# Altium schematic sheet BMS029B_Monitor.SchDoc: Monitor
size 431 x 279 mm; Date: Not shown in title block; ApprovedBy: Not shown in title block; CheckedBy: Not shown in title block; Author: Not shown in title block; CompanyName: Not shown in title block; Engineer: Not shown in title block; Organization: Not shown in title block; Address1: Not shown in title block; Address2: Not shown in title block; Address3: Not shown in title block; Address4: Not shown in title block; DocumentNumber: 1; Revision: Use project parameter SCH_Rev; SheetNumber: 1; SheetTotal: 5; PageSetup: Record=PageOptions|CenterHorizontal=True|CenterVertical=True|PrintScale=1.00|XCorrection=1.00|YCorrection=1.00|PrintKind=0|BorderSize=5000000|LeftOffset=0|BottomOffset=0|Orientation=2|PaperLength=1000|PaperWidth=1000|Scale=100|PaperSource=15|PrintQuality=600|MediaType=1|DitherType=10|PaperKind=Letter|PrintScaleMode=1; CurrentTime: Not shown in title block; CurrentDate: Not shown in title block; Time: Not shown in title block; DocumentFullPathAndName: Not shown in title block; DocumentName: Not shown in title block; ModifiedDate: Not shown in title block; ImagePath: Not shown in title block
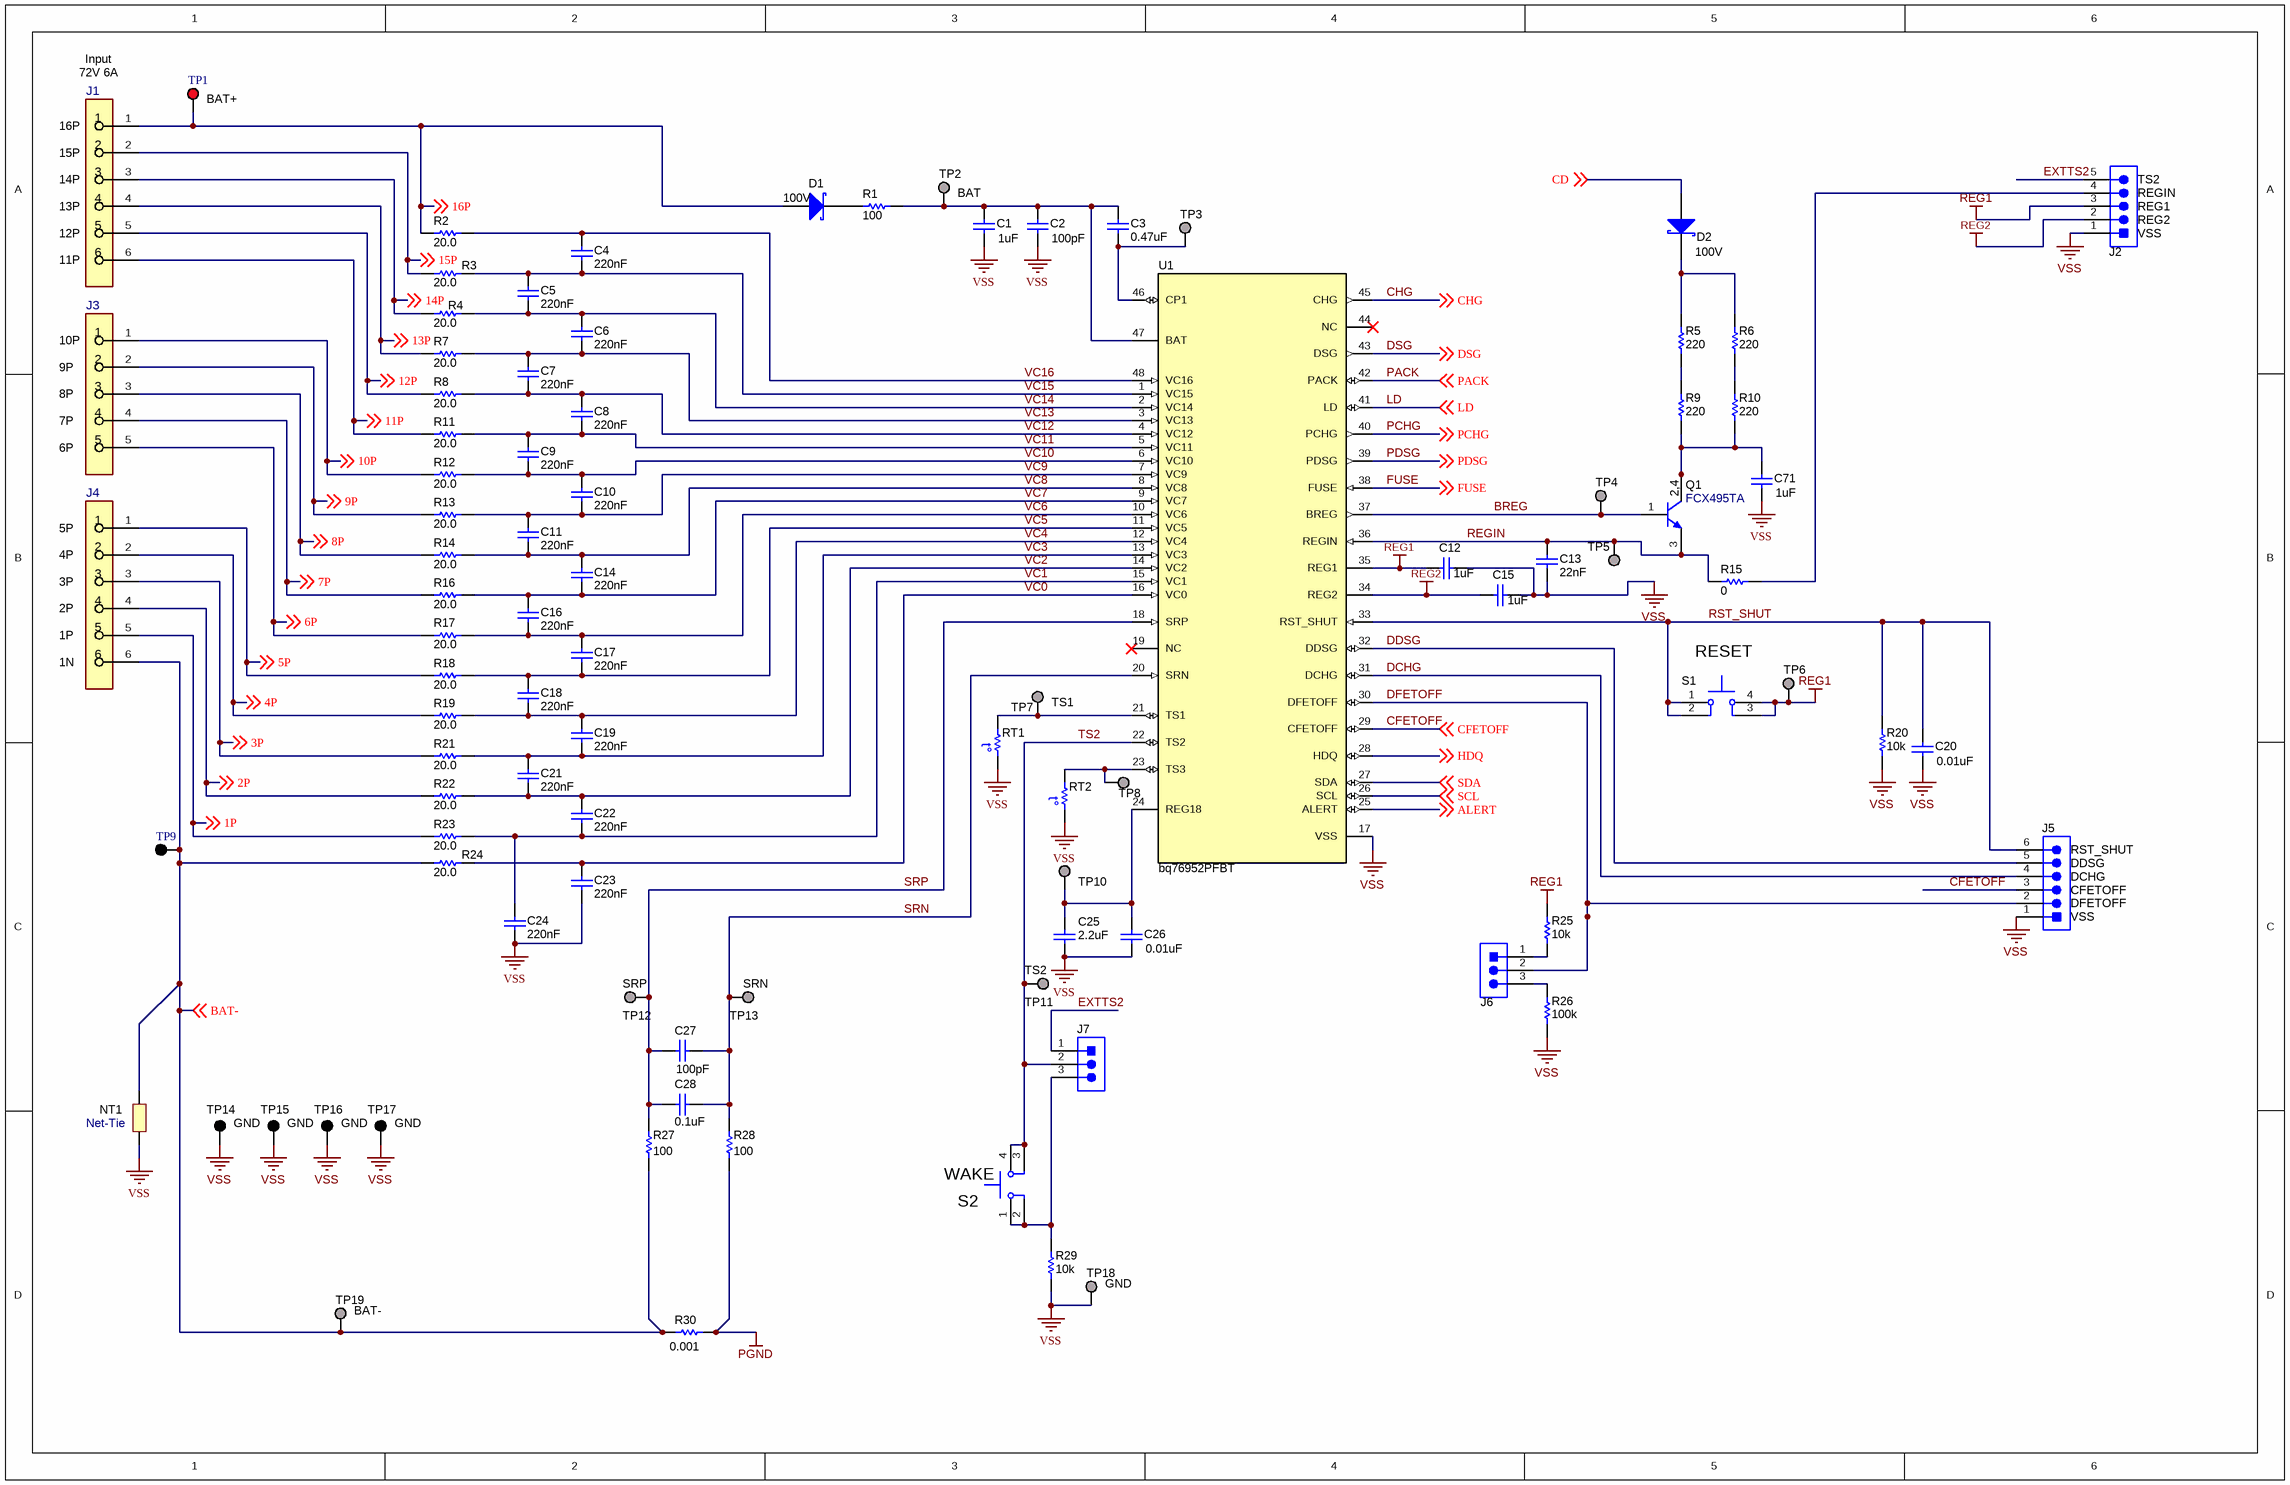
[diagram p0: BMS029B_Monitor.SchDoc]

## Parts
C1  ValueDisplayed: 1uF  [1206_180]  (hidden comment: C3216X7R2A105K160AA)
C2  ValueDisplayed: 100pF  [0603]  (hidden comment: GCM1885C2A101JA16D)
C3  ValueDisplayed: 0.47uF  [0805_HV]  (hidden comment: GCM219R71E474KA55D)
C4  Cap_F: 220nF  [0603S]  (hidden comment: C1608X7R1H224K080AB)
C5  Cap_F: 220nF  [0603S]  (hidden comment: C1608X7R1H224K080AB)
C6  Cap_F: 220nF  [0603S]  (hidden comment: C1608X7R1H224K080AB)
C7  Cap_F: 220nF  [0603S]  (hidden comment: C1608X7R1H224K080AB)
C8  Cap_F: 220nF  [0603S]  (hidden comment: C1608X7R1H224K080AB)
C9  Cap_F: 220nF  [0603S]  (hidden comment: C1608X7R1H224K080AB)
C10  Cap_F: 220nF  [0603S]  (hidden comment: C1608X7R1H224K080AB)
C11  Cap_F: 220nF  [0603S]  (hidden comment: C1608X7R1H224K080AB)
C12  ValueDisplayed: 1uF  [0805_HV]  (hidden comment: EMK212B7105KG-T)
C13  Cap_F: 22nF  [0603]  (hidden comment: C0603C223K4RACTU)
C14  Cap_F: 220nF  [0603S]  (hidden comment: C1608X7R1H224K080AB)
C15  ValueDisplayed: 1uF  [0805_HV]  (hidden comment: EMK212B7105KG-T)
C16  Cap_F: 220nF  [0603S]  (hidden comment: C1608X7R1H224K080AB)
C17  Cap_F: 220nF  [0603S]  (hidden comment: C1608X7R1H224K080AB)
C18  Cap_F: 220nF  [0603S]  (hidden comment: C1608X7R1H224K080AB)
C19  Cap_F: 220nF  [0603S]  (hidden comment: C1608X7R1H224K080AB)
C20  ValueDisplayed: 0.01uF  [0603]  (hidden comment: 885012206040)
C21  Cap_F: 220nF  [0603S]  (hidden comment: C1608X7R1H224K080AB)
C22  Cap_F: 220nF  [0603S]  (hidden comment: C1608X7R1H224K080AB)
C23  Cap_F: 220nF  [0603S]  (hidden comment: C1608X7R1H224K080AB)
C24  Cap_F: 220nF  [0603S]  (hidden comment: C1608X7R1H224K080AB)
C25  ValueDisplayed: 2.2uF  [0805_HV]  (hidden comment: EMK212B7225KG-T)
C26  ValueDisplayed: 0.01uF  [0603]  (hidden comment: 885012206040)
C27  ValueDisplayed: 100pF  [0603]  (hidden comment: C0603C101J5GACTU)
C28  ValueDisplayed: 0.1uF  [0603]  (hidden comment: 885012206095)
C71  ValueDisplayed: 1uF  [1206_180]  (hidden comment: C3216X7R2A105K160AA)
D1  value 100V  [SOD-123]  (hidden comment: BAT46W-7-F)
D2  value 100V  [SOD-123]  (hidden comment: BAT46W-7-F)
J1  OSTTE060161  [FP-OSTTE060161_HDR6-MFG]  (value not drawn)
J2  PEC05SAAN  [Sullins_PxC05SAAN]  (value not drawn)
J3  OSTTE050161  [FP-OSTTE050161_HDR5-MFG]  (value not drawn)
J4  OSTTE060161  [FP-OSTTE060161_HDR6-MFG]  (value not drawn)
J5  PEC06SAAN  [Sullins_PEC06SAAN]  (value not drawn)
J6  87898-0304  [Molex_87898-0304]  (value not drawn)
J7  87898-0304  [Molex_87898-0304]  (value not drawn)
NT1  Net-Tie  [Net-Tie_10milWide_30milLong]  (net tie, no BOM)
Q1  FCX495TA  [SOT-89-3]
R1  ValueDisplayed: 100  [0603]  (hidden comment: Resistor)
R2  ValueDisplayed: 20.0  [1206]  (hidden comment: CRCW120620R0FKEA)
R3  ValueDisplayed: 20.0  [1206]  (hidden comment: CRCW120620R0FKEA)
R4  ValueDisplayed: 20.0  [1206]  (hidden comment: CRCW120620R0FKEA)
R5  ValueDisplayed: 220  [2512]  (hidden comment: CRCW2512220RJNEG)
R6  ValueDisplayed: 220  [2512]  (hidden comment: CRCW2512220RJNEG)
R7  ValueDisplayed: 20.0  [1206]  (hidden comment: CRCW120620R0FKEA)
R8  ValueDisplayed: 20.0  [1206]  (hidden comment: CRCW120620R0FKEA)
R9  ValueDisplayed: 220  [2512]  (hidden comment: CRCW2512220RJNEG)
R10  ValueDisplayed: 220  [2512]  (hidden comment: CRCW2512220RJNEG)
R11  ValueDisplayed: 20.0  [1206]  (hidden comment: CRCW120620R0FKEA)
R12  ValueDisplayed: 20.0  [1206]  (hidden comment: CRCW120620R0FKEA)
R13  ValueDisplayed: 20.0  [1206]  (hidden comment: CRCW120620R0FKEA)
R14  ValueDisplayed: 20.0  [1206]  (hidden comment: CRCW120620R0FKEA)
R15  ValueDisplayed: 0  [0603]  (hidden comment: CRCW06030000Z0EA)
R16  ValueDisplayed: 20.0  [1206]  (hidden comment: CRCW120620R0FKEA)
R17  ValueDisplayed: 20.0  [1206]  (hidden comment: CRCW120620R0FKEA)
R18  ValueDisplayed: 20.0  [1206]  (hidden comment: CRCW120620R0FKEA)
R19  ValueDisplayed: 20.0  [1206]  (hidden comment: CRCW120620R0FKEA)
R20  ValueDisplayed: 10k  [0603]  (hidden comment: CRCW060310K0JNEA)
R21  ValueDisplayed: 20.0  [1206]  (hidden comment: CRCW120620R0FKEA)
R22  ValueDisplayed: 20.0  [1206]  (hidden comment: CRCW120620R0FKEA)
R23  ValueDisplayed: 20.0  [1206]  (hidden comment: CRCW120620R0FKEA)
R24  ValueDisplayed: 20.0  [1206]  (hidden comment: CRCW120620R0FKEA)
R25  ValueDisplayed: 10k  [0603]  (hidden comment: CRCW060310K0JNEA)
R26  ValueDisplayed: 100k  [0603]  (hidden comment: CRCW0603100KJNEA)
R27  ValueDisplayed: 100  [0603]  (hidden comment: Resistor)
R28  ValueDisplayed: 100  [0603]  (hidden comment: Resistor)
R29  ValueDisplayed: 10k  [0603]  (hidden comment: CRCW060310K0JNEA)
R30  ValueDisplayed: 0.001  [1210M]  (hidden comment: Resistor)
RT1  Thermistor  [THERMISTOR_103AT-2]  (value not drawn)
RT2  Thermistor  [THERMISTOR_103AT-2]  (value not drawn)
S1  SW_KST221JLFS  [SW_KST221JLFS]  (value not drawn)
S2  SW_KST221JLFS  [SW_KST221JLFS]  (value not drawn)
TP1  TESTPOINT  [Keystone5010]  (value not drawn)
TP2  TESTPOINT  [TP_VIA_060RND040]  (value not drawn)  (no BOM)
TP3  TESTPOINT  [TP_VIA_060RND040]  (value not drawn)  (no BOM)
TP4  TESTPOINT  [TP_VIA_060RND040]  (value not drawn)  (no BOM)
TP5  TESTPOINT  [TP_VIA_060RND040]  (value not drawn)  (no BOM)
TP6  TESTPOINT  [TP_VIA_060RND040]  (value not drawn)  (no BOM)
TP7  TESTPOINT  [TP_VIA_060RND040]  (value not drawn)  (no BOM)
TP8  TESTPOINT  [TP_VIA_060RND040]  (value not drawn)  (no BOM)
TP9  TESTPOINT  [Keystone5011]  (value not drawn)
TP10  TESTPOINT  [TP_50MIL-25MILHOLE]  (value not drawn)  (no BOM)
TP11  TESTPOINT  [TP_50MIL-25MILHOLE]  (value not drawn)  (no BOM)
TP12  TESTPOINT  [TP_50MIL-25MILHOLE]  (value not drawn)  (no BOM)
TP13  TESTPOINT  [TP_50MIL-25MILHOLE]  (value not drawn)  (no BOM)
TP14  5006  [Keystone5006]  (value not drawn)
TP15  5006  [Keystone5006]  (value not drawn)
TP16  5006  [Keystone5006]  (value not drawn)
TP17  5006  [Keystone5006]  (value not drawn)
TP18  TESTPOINT  [TP_VIA_060RND040]  (value not drawn)  (no BOM)
TP19  TESTPOINT  [TP_VIA_060RND040]  (value not drawn)  (no BOM)
U1  bq76952PFBT  [PFB0048A_N]

## Nets
PGND: R28.1 R30.1
REG1: C12.2 J2.3 R25.1 S1.3 S1.4 TP6.1 U1.35(REG1)
REG2: C15.2 J2.2 U1.34(REG2)
VSS: C1.2 C2.2 C12.1 C13.1 C15.1 C20.2 C23.2 C24.2 C25.1 C26.2 C71.2 J2.1 J5.1 NT1.1 R20.2 R26.1 R29.1 RT1.2 RT2.2 TP14.1 TP15.1 TP16.1 TP17.1 TP18.1 U1.17(VSS)
1P: J4.5 R23.1 ; off-sheet 1P
2P: J4.4 R22.1 ; off-sheet 2P
3P: J4.3 R21.1 ; off-sheet 3P
4P: J4.2 R19.1 ; off-sheet 4P
5P: J4.1 R18.1 ; off-sheet 5P
6P: J3.5 R17.1 ; off-sheet 6P
7P: J3.4 R16.1 ; off-sheet 7P
8P: J3.3 R14.1 ; off-sheet 8P
9P: J3.2 R13.1 ; off-sheet 9P
10P: J3.1 R12.1 ; off-sheet 10P
11P: J1.6 R11.1 ; off-sheet 11P
12P: J1.5 R8.1 ; off-sheet 12P
13P: J1.4 R7.1 ; off-sheet 13P
14P: J1.3 R4.1 ; off-sheet 14P
15P: J1.2 R3.1 ; off-sheet 15P
16P: D1.2(A) J1.1 R2.1 TP1.1 ; off-sheet 16P
ALERT: U1.25(ALERT) ; off-sheet ALERT
BAT-: J4.6 NT1.2 R24.1 R27.1 R30.2 TP9.1 TP19.1 ; off-sheet BAT-
BREG: Q1.1(B) TP4.1 U1.37(BREG)
CD: D2.2(A) ; off-sheet CD
CFETOFF: J5.3 U1.29(CFETOFF) ; off-sheet CFETOFF
CHG: U1.45(CHG) ; off-sheet CHG
DCHG: J5.4 U1.31(DCHG)
DDSG: J5.5 U1.32(DDSG)
DFETOFF: J5.2 J6.2 U1.30(DFETOFF)
DSG: U1.43(DSG) ; off-sheet DSG
EXTTS2: J2.5 J7.1
FUSE: U1.38(FUSE) ; off-sheet FUSE
HDQ: U1.28(HDQ) ; off-sheet HDQ
LD: U1.41(LD) ; off-sheet LD
PACK: U1.42(PACK) ; off-sheet PACK
PCHG: U1.40(PCHG) ; off-sheet PCHG
PDSG: U1.39(PDSG) ; off-sheet PDSG
REGIN: C13.2 Q1.3(E) R15.1 TP5.1 U1.36(REGIN)
RST_SHUT: C20.1 J5.6 R20.1 S1.1 S1.2 U1.33(RST_SHUT)
SCL: U1.26(SCL) ; off-sheet SCL
SDA: U1.27(SDA) ; off-sheet SDA
SRN: C27.1 C28.2 R28.2 TP13.1 U1.20(SRN)
SRP: C27.2 C28.1 R27.2 TP12.1 U1.18(SRP)
TS2: J7.2 S2.3 S2.4 TP11.1 U1.22(TS2)
VC0: C23.1 R24.2 U1.16(VC0)
VC1: C22.2 C24.1 R23.2 U1.15(VC1)
VC2: C21.2 C22.1 R22.2 U1.14(VC2)
VC3: C19.2 C21.1 R21.2 U1.13(VC3)
VC4: C18.2 C19.1 R19.2 U1.12(VC4)
VC5: C17.2 C18.1 R18.2 U1.11(VC5)
VC6: C16.2 C17.1 R17.2 U1.10(VC6)
VC7: C14.2 C16.1 R16.2 U1.9(VC7)
VC8: C11.2 C14.1 R14.2 U1.8(VC8)
VC9: C10.2 C11.1 R13.2 U1.7(VC9)
VC10: C9.2 C10.1 R12.2 U1.6(VC10)
VC11: C8.2 C9.1 R11.2 U1.5(VC11)
VC12: C7.2 C8.1 R8.2 U1.4(VC12)
VC13: C6.2 C7.1 R7.2 U1.3(VC13)
VC14: C5.2 C6.1 R4.2 U1.2(VC14)
VC15: C4.2 C5.1 R3.2 U1.1(VC15)
VC16: C4.1 R2.2 U1.48(VC16)
NetC1_1: C1.1 C2.1 C3.1 R1.1 TP2.1 U1.47(BAT)
NetC3_2: C3.2 TP3.1 U1.46(CP1)
NetC25_2: C25.2 C26.1 TP10.1 U1.24(REG18)
NetC71_1: C71.1 Q1.2(C) Q1.4(C) R9.1 R10.1
NetD1_1: D1.1(K) R1.2
NetD2_1: D2.1(K) R5.2 R6.2
NetJ2_4: J2.4 R15.2
NetJ6_1: J6.1 R25.2
NetJ6_3: J6.3 R26.2
NetJ7_3: J7.3 R29.2 S2.1 S2.2
NetR5_1: R5.1 R9.2
NetR6_1: R6.1 R10.2
NetRT1_1: RT1.1 TP7.1 U1.21(TS1)
NetRT2_1: RT2.1 TP8.1 U1.23(TS3)

Not connected (* = marked no-connect by the designer): U1 19(NC)* 44(NC)*

## Notes on the sheet
- Input
- (near J1) 72V 6A
- (near TP1) BAT+
- (near J1) 15P
- (near J1) 16P
- (near J1) 13P
- (near J1) 12P
- (near J1) 14P
- BAT
- (near J2) TS2
- (near J2) REGIN
- (near J2) REG1
- (near J2) VSS
- (near J2) REG2
- (near J1) 11P
- (near J3) 9P
- (near J3) 10P
- (near J3) 7P
- (near J3) 8P
- (near J3) 6P
- (near J4) 4P
- (near J4) 5P
- (near J4) 2P
- (near J4) 1P
- (near J4) 3P
- (near J4) 1N
- (near TP7) TS1
- RESET
- (near J5) DFETOFF
- (near J5) DDSG
- (near J5) DCHG
- (near J5) RST_SHUT
- (near J5) CFETOFF
- (near TP11) TS2
- (near J5) VSS
- (near TP12) SRP
- (near TP13) SRN
- GND
- (near TP17) GND
- (near S2) WAKE
- (near TP18) GND
- (near TP19) BAT-
- (in symbol CMP-0000510-2) 2,4
- (in symbol CMP-0002341-2) t°

## Library data of the parts
C1 C71 = CMP-0008710-2: CAP, CERM, 1 uF, 100 V, +/- 10%, X7R, 1206; Manufacturer: TDK; TaMin_C: -55°C; ESR_ohm: 4.575m; Polarized: N; SizeAreaWB_mm2: 10.92; Value1: 0.004575 ohm; U/M: EA; Value: 1uF; TaMax_C: 125°C; SizeZ_mm: 1.8; SizeX_mm: 3.2; SizeY_mm: 1.6; Value2: 100V; SizeArea_mm2: 5.12; Cap_F: 1µF; IRMS_A: 3.39639A; AEC Category: Q200; Supplier Part Number 2: 810-C3216X7R2A105K160AA; Publisher: Texas Instruments; Supplier 2: Mouser; TempCo: X7R; Published: 2008-06-19; RoHS: Y; MountType: SMT; Supplier 1: Digi-Key; PackageReference: 1206; Tolerance_%: 10%; Cap_Case: 1206_180; CompType: Capacitor; LatestRevisionDate: 2017-03-09; PartNumber: C3216X7R2A105K160AA; AEC Qualified: N; VDC_V: 100V; ComponentLink1Description: Datasheet link; AEC Grade: N/A; Supplier Part Number 1: 445-4467-1-ND; Technology: Ceramic; ComponentLink1URL: https://product.tdk.com/en/search/capacitor/ceramic/mlcc/info?part_no=C3216X7R2A105K160AA
C2 = CMP-0007130-4: CAP, CERM, 100 pF, 100 V, +/- 5%, C0G/NP0, AEC-Q200 Grade 1, 0603; Manufacturer: MuRata; TaMin_C: -55°C; Polarized: N; SizeAreaWB_mm2: 4.68; Value1: Unknown; U/M: EA; TaMax_C: 125°C; SizeZ_mm: 1; SizeX_mm: 1.6; SizeY_mm: 0.8; Value2: 100V; SizeArea_mm2: 1.28; AEC Qualified: Y; AEC Category: Q200; Value: 100pF; Supplier Part Number 2: 81-GCM1885C2A101JA6D; Publisher: Texas Instruments; Supplier 2: Mouser; TempCo: C0G/NP0; Published: 2008-06-19; RoHS: Y; MountType: SMT; Supplier 1: Digi-Key; PackageReference: 0603; Tolerance_%: 5%; Cap_Case: 0603; CompType: Capacitor; LatestRevisionDate: 2017-03-09; PartNumber: GCM1885C2A101JA16D; Cap_F: 100pF; VDC_V: 100V; ComponentLink1Description: Datasheet link; AEC Grade: 1; Supplier Part Number 1: 490-4771-1-ND; Technology: Ceramic; ComponentLink1URL: http://psearch.murata.com/capacitor/product/GCM1885C2A101JA16%23.pdf
C3 = CMP-0008010-2: CAP, CERM, 0.47 uF, 25 V, +/- 10%, X7R, AEC-Q200 Grade 1, 0805; Manufacturer: MuRata; TaMin_C: -55°C; Polarized: N; SizeAreaWB_mm2: 6.75; Value1: Unknown; U/M: EA; Value: 0.47uF; TaMax_C: 125°C; SizeZ_mm: 1.45; SizeX_mm: 2; SizeY_mm: 1.25; Cap_Case: 0805; Value2: 25V; SizeArea_mm2: 2.5; AEC Qualified: Y; Cap_F: 470nF; AEC Grade: 1; AEC Category: Q200; Supplier Part Number 2: 81-GCM219R71E474KA5D; Publisher: Texas Instruments; Supplier 2: Mouser; TempCo: X7R; Published: 2008-06-19; RoHS: Y; MountType: SMT; Supplier 1: Digi-Key; PackageReference: 0805; Tolerance_%: 10%; CompType: Capacitor; LatestRevisionDate: 2017-03-09; PartNumber: GCM219R71E474KA55D; VDC_V: 25V; ComponentLink1Description: Datasheet link; Supplier Part Number 1: 490-8044-1-ND; Technology: Ceramic; ComponentLink1URL: http://psearch.murata.com/capacitor/product/GCM219R71E474KA55%23.pdf
C4-C11 C14 C16-C19 C21-C24 = CMP-0007047-4: CAP, CERM, 0.22 uF, 50 V, +/- 10%, X7R, 0603; Manufacturer: TDK; TaMin_C: -55°C; ESR_ohm: 0.021699; Polarized: N; SizeAreaWB_mm2: 4.68; Value1: 0.021699 ohm; U/M: EA; Value: 0.22uF; TaMax_C: 125°C; SizeZ_mm: 1; SizeX_mm: 1.6; SizeY_mm: 0.8; Cap_Case: 0603; Value2: 50V; SizeArea_mm2: 1.28; IRMS_A: 1.12496A; AEC Category: Q200; Supplier Part Number 2: 04X3259; Publisher: Texas Instruments; Supplier 2: Newark; Supplier Part Number 3: 810-C1608X7R1H224K; TempCo: X7R; Supplier 3: Mouser; Published: 2008-06-19; RoHS: Y; MountType: SMT; Supplier 1: Digi-Key; PackageReference: 0603; Tolerance_%: 10%; CompType: Capacitor; LatestRevisionDate: 2017-03-09; PartNumber: C1608X7R1H224K080AB; AEC Qualified: N; VDC_V: 50V; ComponentLink1Description: Datasheet link; AEC Grade: N/A; Supplier Part Number 1: 445-7408-1-ND; Technology: Ceramic; ValueDisplayed: 0.22uF; ComponentLink1URL: https://product.tdk.com/en/search/capacitor/ceramic/mlcc/info?part_no=C1608X7R1H224K080AB
C12 C15 = CMP-0008000-2: CAP, CERM, 1 uF, 16 V, +/- 10%, X7R, 0805; Manufacturer: Taiyo Yuden; TaMin_C: -55°C; Polarized: N; SizeAreaWB_mm2: 6.75; Value1: Unknown; U/M: EA; Value: 1uF; TaMax_C: 125°C; SizeZ_mm: 1.45; SizeX_mm: 2; SizeY_mm: 1.25; Cap_Case: 0805; Value2: 16V; SizeArea_mm2: 2.5; Cap_F: 1µF; AEC Category: Q200; Supplier Part Number 2: 1683653; Publisher: Texas Instruments; Supplier 2: Farnell; TempCo: X7R; Published: 2008-06-19; RoHS: Y; MountType: SMT; Supplier 1: Digi-Key; PackageReference: 0805; Tolerance_%: 10%; CompType: Capacitor; LatestRevisionDate: 2017-03-09; PartNumber: EMK212B7105KG-T; AEC Qualified: ?; VDC_V: 16V; ComponentLink1Description: Datasheet link; Supplier Part Number 1: 587-1283-1-ND; Technology: Ceramic; ComponentLink1URL: http://www.yuden.co.jp/ut/product/pdf/djmk_e.pdf
C13 = CMP-0006900-4: CAP, CERM, 0.022 uF, 16 V, +/- 10%, X7R, 0603; Manufacturer: Kemet; TaMin_C: -55°C; Polarized: N; SizeAreaWB_mm2: 4.68; Value1: Unknown; U/M: EA; TaMax_C: 125°C; SizeZ_mm: 1; SizeX_mm: 1.6; SizeY_mm: 0.8; Value2: 16V; SizeArea_mm2: 1.28; AEC Category: Q200; Supplier Part Number 2: 80-C0603C223K4R; Publisher: Texas Instruments; Supplier 2: Mouser; TempCo: X7R; Published: 2008-06-19; RoHS: Y; MountType: SMT; Value: 0.022uF; Supplier 1: Digi-Key; PackageReference: 0603; Tolerance_%: 10%; Cap_Case: 0603; CompType: Capacitor; LatestRevisionDate: 2017-03-09; PartNumber: C0603C223K4RACTU; AEC Qualified: ?; VDC_V: 16V; ComponentLink1Description: Datasheet link; Supplier Part Number 1: 399-1093-1-ND; Technology: Ceramic; ValueDisplayed: 0.022uF; ComponentLink1URL: http://www.kemet.com/kemet/web/homepage/kechome.nsf/vapubfiles/F3102_Y5V.pdf/$file/F3102_Y5V.pdf; Supplier 3: Farnell; Supplier Part Number 3: 1204523
C20 C26 = CMP-0006828-4: CAP, CERM, 0.01 uF, 16 V, +/- 10%, X7R, 0603; Manufacturer: Wurth Elektronik; TaMin_C: -55°C; Polarized: N; SizeAreaWB_mm2: 4.68; Value1: Unknown; U/M: EA; Value: 0.01uF; TaMax_C: 125°C; SizeZ_mm: 1; SizeX_mm: 1.6; SizeY_mm: 0.8; Value2: 16V; SizeArea_mm2: 1.28; Cap_F: 10nF; AEC Category: Q200; Supplier Part Number 2: 710-885012206040; Publisher: Texas Instruments; Supplier 2: Mouser; TempCo: X7R; Published: 2008-06-19; RoHS: Y; MountType: SMT; Supplier 1: Digi-Key; PackageReference: 0603; Tolerance_%: 10%; Cap_Case: 0603; CompType: Capacitor; LatestRevisionDate: 2017-03-09; PartNumber: 885012206040; AEC Qualified: N; VDC_V: 16V; ComponentLink1Description: Datasheet link; AEC Grade: N/A; Supplier Part Number 1: 732-7959-1-ND; Technology: Ceramic; ComponentLink1URL: http://katalog.we-online.de/pbs/datasheet/885012206040.pdf
C25 = CMP-0008001-2: CAP, CERM, 2.2 uF, 16 V, +/- 10%, X7R, 0805; Manufacturer: Taiyo Yuden; TaMin_C: -55°C; Polarized: N; SizeAreaWB_mm2: 6.75; Value1: Unknown; U/M: EA; Value: 2.2uF; TaMax_C: 125°C; SizeZ_mm: 1.45; SizeX_mm: 2; SizeY_mm: 1.25; Cap_Case: 0805; Value2: 16V; SizeArea_mm2: 2.5; Cap_F: 2.2µF; AEC Category: Q200; Supplier Part Number 2: 1683654; Publisher: Texas Instruments; Supplier 2: Farnell; TempCo: X7R; Published: 2008-06-19; RoHS: Y; MountType: SMT; Supplier 1: Digi-Key; PackageReference: 0805; Tolerance_%: 10%; CompType: Capacitor; LatestRevisionDate: 2017-03-09; PartNumber: EMK212B7225KG-T; AEC Qualified: ?; VDC_V: 16V; ComponentLink1Description: Datasheet link; Supplier Part Number 1: 587-1431-1-ND; Technology: Ceramic; ComponentLink1URL: http://www.yuden.co.jp/ut/product/pdf/djmk_e.pdf
C27 = CMP-0006841-4: CAP, CERM, 100 pF, 50 V, +/- 5%, C0G/NP0, 0603; Manufacturer: Kemet; TaMin_C: -55°C; Polarized: N; SizeAreaWB_mm2: 4.68; Value1: Unknown; U/M: EA; Value: 100pF; TaMax_C: 125°C; SizeZ_mm: 1; SizeX_mm: 1.6; SizeY_mm: 0.8; Value2: 50V; SizeArea_mm2: 1.28; AEC Category: Q200; Supplier Part Number 2: 80-C0603C101J5G; Publisher: Texas Instruments; Supplier 2: Mouser; Supplier Part Number 3: 1414603; TempCo: C0G/NP0; Supplier 3: Farnell; Published: 2008-06-19; RoHS: Y; MountType: SMT; Supplier 1: Digi-Key; PackageReference: 0603; Tolerance_%: 5%; Cap_Case: 0603; CompType: Capacitor; LatestRevisionDate: 2017-03-09; PartNumber: C0603C101J5GACTU; AEC Qualified: ?; Cap_F: 100pF; VDC_V: 50V; ComponentLink1Description: Datasheet link; Supplier Part Number 1: 399-1061-1-ND; Technology: Ceramic; ComponentLink1URL: http://www.kemet.com/kemet/web/homepage/kechome.nsf/vapubfiles/F3102_Y5V.pdf/$file/F3102_Y5V.pdf
C28 = CMP-0006837-4: CAP, CERM, 0.1 uF, 50 V, +/- 10%, X7R, 0603; Manufacturer: Wurth Elektronik; TaMin_C: -55°C; Polarized: N; SizeAreaWB_mm2: 4.68; Value1: Unknown; U/M: EA; Value: 0.1uF; TaMax_C: 125°C; SizeZ_mm: 1; SizeX_mm: 1.6; SizeY_mm: 0.8; Value2: 50V; SizeArea_mm2: 1.28; Cap_F: 100nF; AEC Category: Q200; Publisher: Texas Instruments; TempCo: X7R; Published: 2008-06-19; RoHS: Y; MountType: SMT; PackageReference: 0603; Tolerance_%: 10%; Cap_Case: 0603; CompType: Capacitor; LatestRevisionDate: 2017-03-09; PartNumber: 885012206095; AEC Qualified: N; ComponentLink1Description: Datasheet link; AEC Grade: N/A; Technology: Ceramic; ComponentLink1URL: http://katalog.we-online.de/pbs/datasheet/885012206095.pdf
D1 D2 = CMP-0028450-2: Diode, Schottky, 100 V, 0.15 A, SOD-123; Manufacturer: Diodes Inc.; Io_A: 150mA; SizeArea_mm2: 6.545; SizeX_mm: 3.85; Value2: 0.6V; Value1: 0.15A; AEC Category: Q101; SizeZ_mm: 1.35; SizeY_mm: 1.7; Green_Lifecycle: Active; Green_REACh: Passed; SizeAreaWB_mm2: 13.095; Vf_V: 600mV; ComponentLink1Description: Datasheet link; MountType: SMT; ComponentLink1URL: http://www.diodes.com/datasheets/ds30044.pdf; Vr_V: 100V; PartNumber: BAT46W-7-F; Type: Schottky; AEC Qualified: ?; Green_EU RoHS-2: Passed; Green_EU RoHS: Passed; CompType: Diode; RoHS: Y; PackageReference: SOD-123
J1 J4 = CMP-0087050-1: TERM BLOCK 3.5MM VERT 6POS PCB; Manufacturer: On Shore Technology; ContactFinish: Tin; Current_A: 10A; Voltage_V: 300V; Row_Count: 1; PinCount: 6; RoHS: TRUE; ComponentLink1URL: http://www.on-shore.com/wp-content/uploads/2019/02/OSTTEXX0161.pdf; ComponentLink1Description: Datasheet; PartNumber: OSTTE060161; Symbol Name: SYM-OSTTE060161; PackageReference: HDR6
J2 = CMP-0054597-1: Header, 2.54mm, 5x1, Tin, TH; Manufacturer: Sullins Connector Solutions; CNHeader: TRUE; Current_A: 3A; Green_Lifecycle: Not Set; Shrouded: N; Gender: Male; Green_REACh: Incomplete; Voltage_V: 1.8kV; Row_Count: 1; Pitch_mm: 2.54; CT: FALSE; Cert_UL: Y; ComponentLink1URL: http://www.sullinscorp.com/catalogs/77_PAGE108-109_.100_MALE_HDR.pdf; ClassName: Header; Publisher: Texas Instruments; Color: Black; RoHS: Y; MountType: TH; Green_EU RoHS-2: Incomplete; Supplier 1: Digi-Key; Green_EU RoHS: Incomplete; PackageReference: Header, 2.54mm, 5x1, TH; PinCount: 5; CompType: Header; LatestRevisionDate: 26/05/2017; PartNumber: PEC05SAAN; Orientation: Vertical; ComponentLink1Description: Datasheet URL; Supplier Part Number 1: S1012E-05-ND; ContactFinish: Tin
J3 = CMP-0087049-1: TERM BLOCK 3.5MM VERT 5POS PCB; Manufacturer: On Shore Technology; Row_Count: 1; ContactFinish: Tin; Current_A: 10A; Voltage_V: 300V; ComponentLink1Description: Datasheet; PinCount: 5; PartNumber: OSTTE050161; RoHS: TRUE; PackageReference: HDR5; Symbol Name: SYM-OSTTE050161; ComponentLink1URL: http://www.on-shore.com/wp-content/uploads/2019/02/OSTTEXX0161.pdf
J5 = CMP-0054567-1: Header, 100mil, 6x1, Tin, TH; Manufacturer: Sullins Connector Solutions; CNHeader: TRUE; Green_Lifecycle: Not Set; Green_REACh: Incomplete; CT: FALSE; ComponentLink1URL: http://www.sullinscorp.com/drawings/77_G_(P,_A,_R)_C___S___N,_STRAIGHT,_C10436.pdf; ClassName: Header; Publisher: Texas Instruments; RoHS: Y; MountType: TH; Green_EU RoHS-2: Incomplete; Supplier 1: Digi-Key; Green_EU RoHS: Incomplete; PackageReference: TH, 6-Leads, Body 608x100mil, Pitch 100mil; CompType: Header; LatestRevisionDate: 26/05/2017; PartNumber: PEC06SAAN; ComponentLink1Description: Datasheet URL; Supplier Part Number 1: S1012E-06-ND
J6 J7 = CMP-0075388-1: Header, 2.54mm, 3x1, Gold, SMT; Manufacturer: Molex; Pitch_mm: 2.54; Gender: Male; Cert_CSA: Y; Current_A: 3A; Voltage_V: 250V; CT: False; Shrouded: N; Row_Count: 1; CNHeader: True; ComponentLink1Description: Datasheet URL; RoHS: Y; Supplier Part Number 3: 538-87898-0304; Supplier 1: Digi-Key; Cert_UL: Y; Orientation: Vertical; PackageReference: Header, 2.54mm, 3x1, SMT; Color: Black; PartNumber: 87898-0304; PinCount: 3; Publisher: Texas Instruments; Supplier Part Number 2: 39T3063; ContactFinish: Gold; Supplier 2: Newark; ClassName: Header; ComponentLink1URL: http://www.molex.com/pdm_docs/sd/878980204_sd.pdf; LatestRevisionDate: 2017-07-14; CompType: Header; MountType: SMT; Supplier Part Number 1: 0878980304-ND; Supplier 3: Mouser
NT1 = CMP-0078142-3: Single point connection between nets.; MountType: SMT; PackageReference: N/A; CompType: Net-Tie; Library Reference: Net-Tie; Manufacturer: N/A; PartNumber: N/A
Q1 = CMP-0000510-2: Transistor, NPN, 150 V, 1 A, AEC-Q101, SOT-89; Manufacturer: Diodes Inc.; TaMax_C: 150°C; Value2: 300; Value1: 1 A; Vcesat1_V: 200mV; SizeX_mm: 4.1; SizeY_mm: 4.5; TaMin_C: -65°C; IcRated_A: 1A; CompType: BJT; SizeZ_mm: 1.5; AEC Qualified: Y; Value: 150 V; SizeArea_mm2: 18.45; NPN: 1; Vceo_V: 150V; PNP: 0; AEC Category: Q101; SizeAreaWB_mm2: 28.05; U/M: EA; Supplier 2: Newark; Supplier 3: Mouser; Supplier 1: Digi-Key; Supplier Part Number 1: FCX495CT-ND; Supplier Part Number 2: 65T9121; Supplier Part Number 3: 522-FCX495TA; PartNumber: FCX495TA; LatestRevisionDate: 2017-03-09; Publisher: Texas Instruments; ComponentLink1Description: Datasheet link; HfeMax: 300; Published: 2008-07-31; RoHS: Y; PackageReference: SOT-89; MountType: SMT; ComponentLink1URL: https://www.diodes.com/assets/Datasheets/FCX495.pdf
R1 R27 R28 = CMP-0025700-4: RES, 100, 5%, 0.1 W, AEC-Q200 Grade 0, 0603; PartNumber: CRCW0603100RJNEA; Manufacturer: Vishay-Dale; Value: 100; Value_Code: 100R; Power_W: 100mW; Value2: 0.1W; VDC_V: 75V; TempCo: 200 ppm/C; EIA_Code: E24; U/M: EA; SizeArea_mm2: 1.28; SizeX_mm: 1.6; SizeY_mm: 0.8; SizeZ_mm: 1; AEC Category: Q200; AEC Qualified: Y; AEC Grade: 0; CompType: Resistor; SymbolVersion: 2009-05-29; PackageReference: 0603; RoHS: E; Res_ohm: 100; Tolerance_%: 5%; Value1: 5%; MountType: SMT; Technology: Thick Film; Published: 2008-06-26; Publisher: Texas Instruments; LatestRevisionDate: 2017-06-13; ComponentLink1Description: Datasheet link; ComponentLink1URL: http://www.vishay.com/docs/20035/dcrcwe3.pdf; Supplier 1: Digi-Key; Supplier Part Number 1: 541-100GCT-ND; Supplier 2: Newark; Supplier Part Number 2: 59M6764; Supplier 3: Mouser; Supplier Part Number 3: 71-CRCW0603J-100-E3
R2 R14 = CMP-0016781-3: RES, 20.0, 1%, 0.25 W, AEC-Q200 Grade 0, 1206; Manufacturer: Vishay-Dale; CompType: Resistor; Value: 20.0; Res_ohm: 20; Value_Code: 20R0; Power_W: 250mW; Value2: 0.25W; VDC_V: 200V; TempCo: 100 ppm/C; EIA_Code: E96; SizeArea_mm2: 5.12; SizeX_mm: 3.2; SizeY_mm: 1.6; SizeZ_mm: 1.35; AEC Category: Q200; AEC Qualified: Y; AEC Grade: 0; PartNumber: CRCW120620R0FKEA; PackageReference: 1206; RoHS: E; Tolerance_%: 1%; Value1: 1%; MountType: SMT; Technology: Thick Film; ComponentLink1Description: Datasheet link; ComponentLink1URL: http://www.vishay.com/docs/20035/dcrcwe3.pdf; Supplier 1: Digi-Key; Supplier Part Number 1: 541-20.0FCT-ND; Supplier 2: Newark; Supplier Part Number 2: 42K4894; Supplier 3: Mouser; Supplier Part Number 3: 71-CRCW1206-20-E3
R3 R4 R7 R8 R11-R13 R16-R19 R21-R24 = CMP-0016781-3: RES, 20.0, 1%, 0.25 W, AEC-Q200 Grade 0, 1206; Manufacturer: Vishay-Dale; Value: 20.0; Res_ohm: 20; Value_Code: 20R0; Power_W: 250mW; Value2: 0.25W; VDC_V: 200V; TempCo: 100 ppm/C; EIA_Code: E96; SizeArea_mm2: 5.12; SizeX_mm: 3.2; SizeY_mm: 1.6; SizeZ_mm: 1.35; AEC Category: Q200; AEC Qualified: Y; AEC Grade: 0; CompType: Resistor; PartNumber: CRCW120620R0FKEA; PackageReference: 1206; RoHS: E; Tolerance_%: 1%; Value1: 1%; MountType: SMT; Technology: Thick Film; ComponentLink1Description: Datasheet link; ComponentLink1URL: http://www.vishay.com/docs/20035/dcrcwe3.pdf; Supplier 1: Digi-Key; Supplier Part Number 1: 541-20.0FCT-ND; Supplier 2: Newark; Supplier Part Number 2: 42K4894; Supplier 3: Mouser; Supplier Part Number 3: 71-CRCW1206-20-E3
R5 R6 R9 R10 = CMP-0015916-3: RES, 220, 5%, 1 W, AEC-Q200 Grade 0, 2512; Manufacturer: Vishay-Dale; Power_W: 1W; TempCo: 200 ppm/C; Value_Code: 220R; Value: 220; EIA_Code: E24; SizeX_mm: 6.3; SizeY_mm: 3.2; SizeZ_mm: 0.71; SizeArea_mm2: 20.16; AEC Qualified: Y; VDC_V: 500V; AEC Grade: 0; AEC Category: Q200; RoHS: E; Value1: 5%; MountType: SMT; Supplier 1: Digi-Key; PackageReference: 2512; Tolerance_%: 5%; Res_ohm: 220; Value2: 1W; CompType: Resistor; PartNumber: CRCW2512220RJNEG; ComponentLink1Description: Datasheet link; Supplier Part Number 1: 541-220XCT-ND; Technology: Thick Film; ComponentLink1URL: http://www.vishay.com/docs/20035/dcrcwe3.pdf
R15 = CMP-0025697-4: RES, 0, 5%, 0.1 W, AEC-Q200 Grade 0, 0603; Manufacturer: Vishay-Dale; Value: 0; Value_Code: 0000; Power_W: 100mW; Value2: 0.1W; VDC_V: 75V; TempCo: 200 ppm/C; EIA_Code: E24; SizeArea_mm2: 1.28; SizeX_mm: 1.6; SizeY_mm: 0.8; SizeZ_mm: 1; AEC Category: Q200; AEC Qualified: Y; CompType: Resistor; PartNumber: CRCW06030000Z0EA; PackageReference: 0603; RoHS: E; Res_ohm: 0; Tolerance_%: 5%; Value1: 5%; MountType: SMT; Technology: Thick Film; ComponentLink1Description: Datasheet link; ComponentLink1URL: http://www.vishay.com/docs/20035/dcrcwe3.pdf; Supplier 1: Digi-Key; Supplier Part Number 1: 541-0.0GCT-ND; Supplier 2: Newark; Supplier Part Number 2: 52K8014; Supplier 3: Mouser; Supplier Part Number 3: 71-CRCW0603-0-E3; AEC Grade: 0
R20 R25 = CMP-0025701-4: RES, 10 k, 5%, 0.1 W, AEC-Q200 Grade 0, 0603; Manufacturer: Vishay-Dale; Power_W: 100mW; TempCo: 200 ppm/C; Value_Code: 10k0; Value: 10k; EIA_Code: E24; SizeX_mm: 1.6; SizeY_mm: 0.8; SizeZ_mm: 1; Value2: 0.1W; SizeArea_mm2: 1.28; AEC Qualified: Y; VDC_V: 75V; AEC Category: Q200; AEC Grade: 0; Supplier Part Number 2: 52K8066; Supplier 2: Newark; Supplier Part Number 3: 71-CRCW0603J-10K-E3; Supplier 3: Mouser; RoHS: E; Value1: 5%; MountType: SMT; Supplier 1: Digi-Key; PackageReference: 0603; Tolerance_%: 5%; Res_ohm: 10k; CompType: Resistor; PartNumber: CRCW060310K0JNEA; ComponentLink1Description: Datasheet link; Supplier Part Number 1: 541-10KGCT-ND; Technology: Thick Film; ComponentLink1URL: http://www.vishay.com/docs/20035/dcrcwe3.pdf
R26 = CMP-0025698-4: RES, 100 k, 5%, 0.1 W, AEC-Q200 Grade 0, 0603; Manufacturer: Vishay-Dale; Power_W: 100mW; TempCo: 200 ppm/C; Value: 100k; EIA_Code: E24; SizeX_mm: 1.6; SizeY_mm: 0.8; SizeZ_mm: 1; Value2: 0.1W; SizeArea_mm2: 1.28; AEC Qualified: Y; VDC_V: 75V; AEC Category: Q200; AEC Grade: 0; Supplier Part Number 2: 59M6763; Supplier 2: Newark; Supplier Part Number 3: 71-CRCW0603J-100K-E3; Supplier 3: Mouser; Value_Code: 100k; RoHS: E; Value1: 5%; MountType: SMT; Supplier 1: Digi-Key; PackageReference: 0603; Tolerance_%: 5%; Res_ohm: 100k; CompType: Resistor; PartNumber: CRCW0603100KJNEA; ComponentLink1Description: Datasheet link; Supplier Part Number 1: 541-100KGCT-ND; Technology: Thick Film; ComponentLink1URL: http://www.vishay.com/docs/20035/dcrcwe3.pdf
R29 = CMP-0025701-4: RES, 10 k, 5%, 0.1 W, AEC-Q200 Grade 0, 0603; Manufacturer: Vishay-Dale; Power_W: 100mW; TempCo: 200 ppm/C; Value_Code: 10k0; Value: 10k; EIA_Code: E24; SizeX_mm: 1.6; SizeY_mm: 0.8; SizeZ_mm: 1; Value2: 0.1W; SizeArea_mm2: 1.28; AEC Qualified: Y; VDC_V: 75V; AEC Grade: 0; AEC Category: Q200; Supplier Part Number 2: 52K8066; Supplier 2: Newark; RoHS: E; Value1: 5%; MountType: SMT; Supplier 1: Digi-Key; PackageReference: 0603; Tolerance_%: 5%; Res_ohm: 10k; CompType: Resistor; PartNumber: CRCW060310K0JNEA; ComponentLink1Description: Datasheet link; Supplier Part Number 1: 541-10KGCT-ND; Technology: Thick Film; ComponentLink1URL: http://www.vishay.com/docs/20035/dcrcwe3.pdf; Supplier 3: Mouser; Supplier Part Number 3: 71-CRCW0603J-10K-E3
R30 = CMP-0015200-2: RES, 0.001, 1%, 1 W, 1210; PartNumber: PMR25HZPFV1L00; Manufacturer: Rohm; Value: 0.001; Res_ohm: 1m; Value_Code: 1L000; Power_W: 1W; TempCo: 100 ppm/C; EIA_Code: E96; U/M: EA; SizeArea_mm2: 8; SizeAreaWB_mm2: 14.7; SizeX_mm: 3.2; SizeY_mm: 2.5; SizeZ_mm: 1.35; AEC Category: Q200; Green_Lifecycle: Active; Green_REACh: Passed; CompType: Resistor; SymbolVersion: 2009-05-29; PackageReference: 1210; RoHS: Y; Tolerance_%: 1%; Value1: 1%; Value2: 1W; MountType: SMT; Technology: Thick Film; Published: 2008-06-26; Publisher: Texas Instruments; LatestRevisionDate: 2017-03-09; ComponentLink1Description: Datasheet link; ComponentLink1URL: http://media.digikey.com/pdf/Data%20Sheets/Rohm%20PDFs/PMR25-Series.pdf; Supplier 1: Digi-Key; Supplier Part Number 1: RHM.001APCT-ND; AEC Qualified: ?; Green_EU RoHS: Passed; Green_EU RoHS-2: Incomplete
RT1 RT2 = CMP-0002341-2: Thermistor NTC, 10.0k ohm, 1%, Disc, 5x8.4 mm; PartNumber: 103AT-2; Manufacturer: SEMITEC Corporation; Power_W: 10mW; TaMin_C: -50°C; TaMax_C: 110°C; U/M: EA; Value: 10k; CompType: ThermistorNTC; SymbolVersion: 2008-11-25; Series: AT; PackageReference: Disc, 5x8.4 mm; Tolerance_%: 1%; MountType: TH; RoHS: Y; ComponentLink1Description: Datasheet link; ComponentLink1URL: http://www.semitec.co.jp/english2/products/pdf/AT_Thermistor.pdf; Published: 22/09/2009; Publisher: Texas Instruments; LatestRevisionDate: 09/03/2017; Supplier 1: Mouser; Supplier Part Number 1: 954-103AT-2
S1 S2 = CMP-0002132-2: Switch, Tactile, SPST-NO, SMT; Manufacturer: C&K Components; SymbolCreator: a0799628; VDC_V: 32V; SwitchFunction: Off-Mom; PositionCount: 1; CurrentRating_mA: 50A; Green_Lifecycle: Active; Green_REACh: Passed; SymbolVersion: 2013-06-10; PartNumber: KST221JLFS; MountType: SMT; ComponentLink1Description: Datasheet URL; ComponentLink1URL: http://www.ck-components.com/index.php?module=media&action=Display&cmpref=14404&lang=en&width=&height=&format=&alt=; RoHS: Y; Circuit: SPST-NO; Orientation: Top Actuated; CompType: Switch; PackageReference: Switch, 6.2X5X6.2 mm; Publisher: Texas Instruments; LatestRevisionDate: 2017-03-09; Supplier 1: Digi-Key; Supplier Part Number 1: 401-1848-1-ND; Supplier 2: Mouser; Supplier Part Number 2: 611-KST221JLFS; Green_EU RoHS: Passed; Green_EU RoHS-2: Passed
TP1 = CMP-0055147-1: Test Point, Multipurpose, Red, TH; Manufacturer: Keystone; CNHeader: FALSE; Green_Lifecycle: Active; Green_REACh: Passed; ContactFinish: Silver; CT: TRUE; CompType: Test Point; PackageReference: Red Multipurpose Testpoint; PartNumber: 5010; ComponentLink1URL: http://www.keyelco.com/userAssets/file/M60-2p60.pdf; Supplier Part Number 2: 534-5010; Publisher: Texas Instruments; Supplier 2: Mouser; Color: Red; RoHS: Y; MountType: TH; Green_EU RoHS-2: Incomplete; Supplier 1: Digi-Key; Green_EU RoHS: Passed; LatestRevisionDate: 26/05/2017; ComponentLink1Description: Datasheet URL; Supplier Part Number 1: 36-5010-ND
TP2-TP8 TP10-TP13 TP18 TP19 = CMP-0078143-2: TEST POINT.  No entry in BOM.; PartNumber: N/A; CompType: Testpoint; Manufacturer: N/A; PackageReference: N/A; Library Reference: TESTPOINT
TP9 = CMP-0055148-1: Test Point, Multipurpose, Black, TH; Manufacturer: Keystone; CNHeader: FALSE; Green_Lifecycle: Active; Green_REACh: Passed; ContactFinish: Silver; CT: TRUE; CompType: Test Point; PackageReference: Black Multipurpose Testpoint; PartNumber: 5011; ComponentLink1URL: http://www.keyelco.com/userAssets/file/M60-2p60.pdf; Supplier Part Number 2: 534-5011; Publisher: Texas Instruments; Supplier 2: Mouser; Color: Black; RoHS: Y; MountType: TH; Green_EU RoHS-2: Incomplete; Supplier 1: Digi-Key; Green_EU RoHS: Passed; LatestRevisionDate: 26/05/2017; ComponentLink1Description: Datasheet URL; Supplier Part Number 1: 36-5011-ND
TP14-TP17 = CMP-0055143-1: Test Point, Compact, Black, TH; Manufacturer: Keystone; ContactFinish: Silver; Green_Lifecycle: Active; Green_REACh: Passed; CNHeader: FALSE; CT: TRUE; SymbolVersion: 2008-04-04; PartNumber: 5006; CompType: Test Point; RoHS: Y; PackageReference: Black Compact Testpoint; MountType: TH; ComponentLink1Description: Datasheet URL; ComponentLink1URL: http://www.keyelco.com/userAssets/file/M60-2p60.pdf; Publisher: Texas Instruments; LatestRevisionDate: 26/05/2017; Supplier 1: Digi-Key; Supplier Part Number 1: 36-5006-ND; Supplier 2: Mouser; Supplier Part Number 2: 534-5006; Color: Black; Green_EU RoHS: Passed; Green_EU RoHS-2: Incomplete
U1 = CMP-0084229-1: Multicell Battery Monitor and Protection Family, PFB0048A (TQFP-48); Alternate PartNumber: bq76952PFBR; Alternate Manufacturer: Texas Instruments; SizeAreaWB_mm2: 121; SizeZ_mm: 1.2; SizeX_mm: 9; SizeArea_mm2: 81; CompType: IC; AEC Qualified: N; AEC Category: Q200; ComponentLink1URL: http://www.ti.com/lit/ds/symlink/bq76952.pdf; PackageDescription: TQFP-48; MountType: SMT; ComponentLink2URL: http://www.ti.com/product/bq76952; ComponentLink3Description: Online Datasheet; ComponentLink2Description: Product Folder; Manufacturer: Texas Instruments; ComponentLink3URL: http://www.ti.com/product/bq76952/datasheet; PackageReference: PFB0048A; SizeY_mm: 9; PartNumber: bq76952PFBT; ComponentLink1Description: Datasheet Link